# EasyEDA schematic Py car_2021-03-04.json
TITLE: Sheet_1; REV: 1.0; Date: 2021-02-25; Sheet: 1/1; Drawn By: Bogdan123123; Company: Your Company
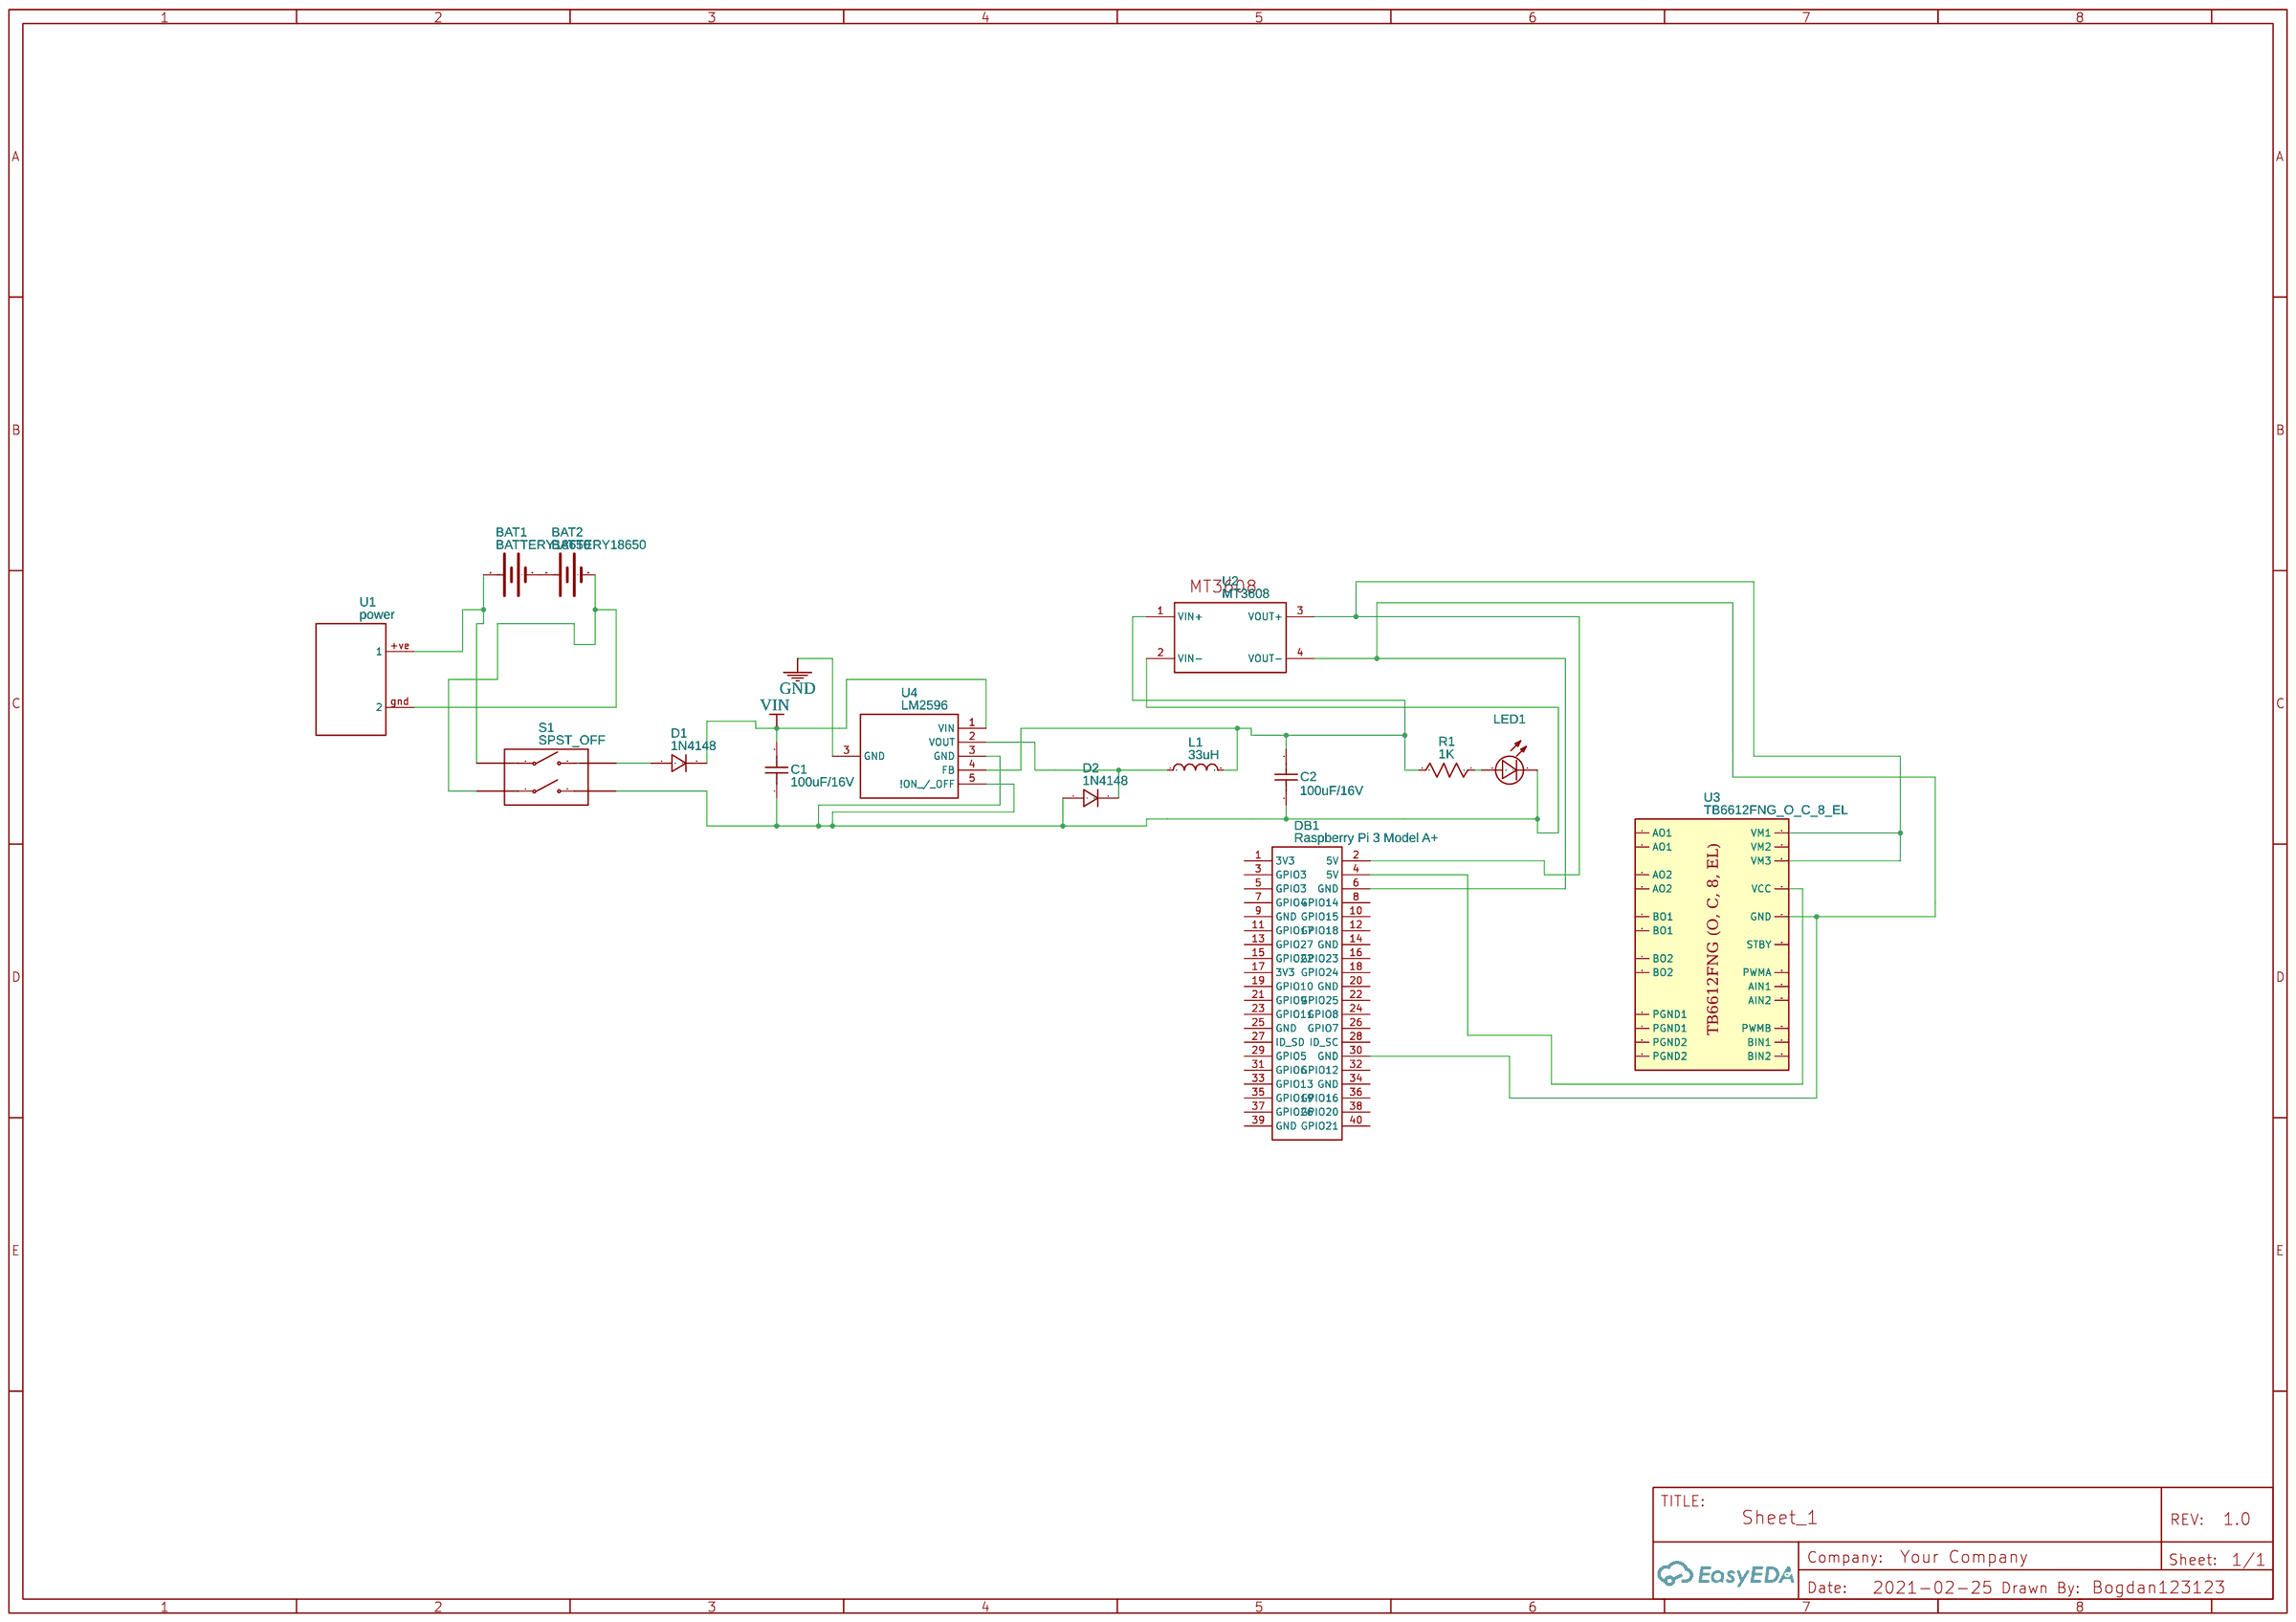
[diagram p0: schematic sheet]

## Parts
BAT1  BATTERY18650  [BATTERY_18650-HOLDER]
BAT2  BATTERY18650  [BATTERY_18650-HOLDER]
C1  100uF/16V  [RAD-0.1]
C2  100uF/16V  [RAD-0.1]
D1  1N4148  [DO-35]
D2  1N4148  [DO-35]
DB1  Raspberry Pi 3 Model A+
L1  33uH  [AXIAL-0.4]
LED1  LED
R1  1K  [AXIAL-0.3]
S1  SPST_OFF  [TACTILE-PTH]
U1  power  [POWER]
U2  MT3608  [MT3608_M]
U3  TB6612FNG_O_C_8_EL  [TB6612FNG(O,C,8,EL)]
U4  LM2596  [TO-263-5]

## Library data of the parts
BAT1 BAT2 = BATTERY18650: Battery Holders; Contributor: SparkFun
C1 C2 = Capacitor_US: Contributor: EasyEDA; Supplier: YUJING; Capacitance: 1u
D1 D2 = 1N4148: Contributor: EasyEDA
DB1 = Raspberry Pi 3 Model A+: Manufacturer: RASPBERRY-PI; Manufacturer Part: RPI3-MODAP; Supplier: Farnell; Supplier Part: 2946269; link: http://www.farnell.com/datasheets/2702628.pdf?_ga=2.235088961.1345213724.1544222275-235847458.1538770094; Contributor: gillfish101
L1 = Inductor: Supplier: YUJING; Contributor: EasyEDA; Inductance: 1m
LED1 = LED: catid: 20; Contributor: 仿真库绘制; Color: Red; NameDisplay: 0
R1 = Resistor_US: Resistance: 1k; Contributor: EasyEDA; Supplier: YUJING
S1 = SPST_OFF
U1 = power: Contributor: sreejeeshs
U2 = MT3608: Contributor: vadimch
U3 = TB6612FNG_O_C_8_EL: catid: 20; Contributor: Matty87; sim: true
U4 = LM2596: catid: 20; Contributor: rnovak1988; link: http://www.ti.com/lit/ds/symlink/lm2596.pdf

## Nets
GND: C1.1 C2.1 D2.1(A) LED1.2(-) U2.2(VIN-) U4.3(GND) U4.5(!ON / OFF)
VIN: C1.2 D1.2(K) U4.1(VIN)
Net-(BAT1-GND@1): BAT1.GND@1(-) BAT2.PWR@1(+)
Net-(BAT1-PWR@1): BAT1.PWR@1(+) U1.+ve(1)
Net-(BAT2-GND@1): BAT2.GND@1(-) U1.gnd(2)
Net-(C2-2): C2.2 L1.2 R1.1 U2.1(VIN+) U4.4(FB)
Net-(D2-2): D2.2(K) L1.1 U4.2(VOUT)
Net-(DB1-2): DB1.2(5V) U2.3(VOUT+) U3.14(VM3) U3.24(VM1)
Net-(DB1-4): DB1.4(5V) U3.20(VCC)
Net-(DB1-6): DB1.6(GND) DB1.30(GND) U2.4(VOUT-) U3.18(GND)
Net-(LED1-1): LED1.1(+) R1.2

Not connected (* = marked no-connect by the designer): D1 1(A); DB1 1(3V3) 3(GPIO3) 5(GPIO3) 7(GPIO4) 8(GPIO14) 9(GND) 10(GPIO15) 11(GPIO17) 12(GPIO18) 13(GPIO27) 14(GND) 15(GPIO22) 16(GPIO23) 17(3V3) 18(GPIO24) 19(GPIO10) 20(GND) 21(GPIO9) 22(GPIO25) 23(GPIO11) 24(GPIO8) 25(GND) 26(GPIO7) 27(ID_SD) 28(ID_SC) 29(GPIO5) 31(GPIO6) 32(GPIO12) 33(GPIO13) 34(GND) 35(GPIO19) 36(GPIO16) 37(GPIO26) 38(GPIO20) 39(GND) 40(GPIO21); S1 1  2 ; U3 1(AO1) 2(AO1) 3(PGND1) 4(PGND1) 5(AO2) 6(AO2) 7(BO2) 8(BO2) 9(PGND2) 10(PGND2) 11(BO1) 12(BO1) 13(VM2) 15(PWMB) 16(BIN2) 17(BIN1) 19(STBY) 21(AIN1) 22(AIN2) 23(PWMA)
